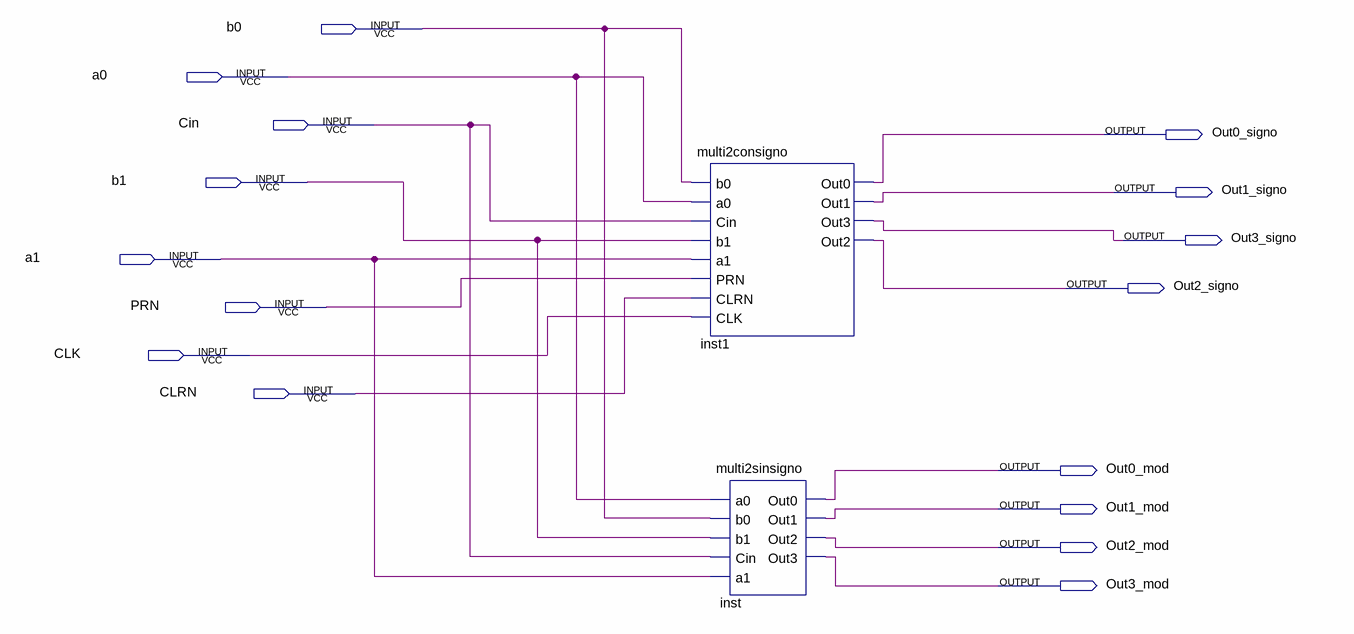
[diagram p0: schematic sheet]
// Quartus schematic Multimodca2.bdf as structural Verilog: 2 symbols, 16 pins
module Multimodca2 (
  input  b0,
  input  a0,
  input  Cin,
  input  b1,
  input  a1,
  input  PRN,
  input  CLK,
  input  CLRN,
  output Out0_signo,
  output Out1_signo,
  output Out3_signo,
  output Out2_signo,
  output Out0_mod,
  output Out1_mod,
  output Out2_mod,
  output Out3_mod
);

  multi2consigno inst1 (
    .b0(b0), .a0(a0), .Cin(Cin), .b1(b1), .a1(a1), .PRN(PRN), .CLRN(CLRN), .CLK(CLK), .Out0(Out0_signo),
    .Out1(Out1_signo), .Out3(Out3_signo), .Out2(Out2_signo));
  multi2sinsigno inst (
    .a0(a0), .b0(b0), .b1(b1), .Cin(Cin), .a1(a1), .Out0(Out0_mod), .Out1(Out1_mod), .Out2(Out2_mod),
    .Out3(Out3_mod));
endmodule
